# EAGLE schematic MOTHERBOARD (EAGLE 6.4)
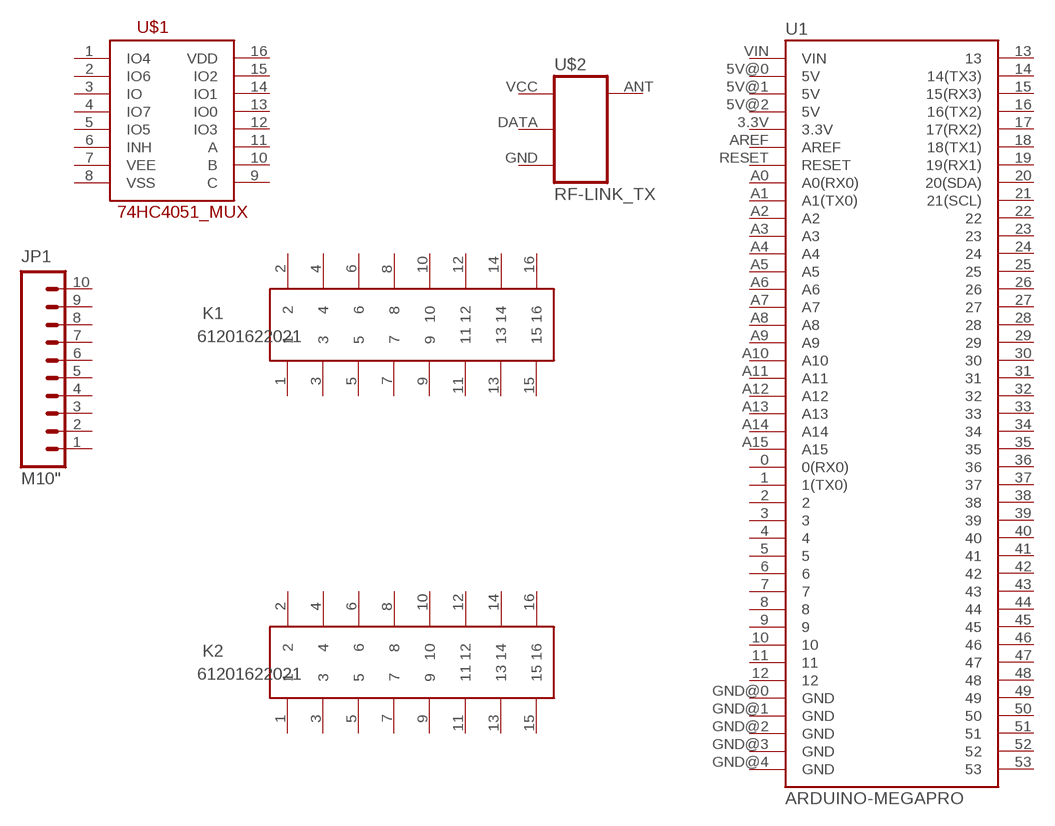
[diagram p0: schematic, sheet 1]

## Parts
JP1  M10"  [1X10]
K1  61201622021  [61201622021]
K2  61201622021  [61201622021]
U1  ARDUINO-MEGAPRO  [ARDUINO_MEGA-PRO-3.3V]
U$1  74HC4051_MUX  [SO16]
U$2  RF-LINK_TX  [RF-LINK_TX]
Unconnected: JP1.1 JP1.2 JP1.3 JP1.4 JP1.5 JP1.6 JP1.7 JP1.8 JP1.9 JP1.10 K1.1 K1.2 K1.3 K1.4 K1.5 K1.6 K1.7 K1.8 K1.9 K1.10 K1.11 K1.12 K1.13 K1.14 K1.15 K1.16 K2.1 K2.2 K2.3 K2.4 K2.5 K2.6 K2.7 K2.8 K2.9 K2.10 K2.11 K2.12 K2.13 K2.14 K2.15 K2.16 U1.0(0(RX0)) U1.1(1(TX0)) U1.2 U1.3 U1.3.3V U1.4 U1.5 U1.5V@0(5V) U1.5V@1(5V) U1.5V@2(5V) U1.6 U1.7 U1.8 U1.9 U1.10 U1.11 U1.12 U1.13 U1.14(14(TX3)) U1.15(15(RX3)) U1.16(16(TX2)) U1.17(17(RX2)) U1.18(18(TX1)) U1.19(19(RX1)) U1.20(20(SDA)) U1.21(21(SCL)) U1.22 U1.23 U1.24 U1.25 U1.26 U1.27 U1.28 U1.29 U1.30 U1.31 U1.32 U1.33 U1.34 U1.35 U1.36 U1.37 U1.38 U1.39 U1.40 U1.41 U1.42 U1.43 U1.44 U1.45 U1.46 U1.47 U1.48 U1.49 U1.50 U1.51 U1.52 U1.53 U1.A0(A0(RX0)) U1.A1(A1(TX0)) U1.A2 U1.A3 U1.A4 U1.A5 U1.A6 U1.A7 U1.A8 U1.A9 U1.A10 U1.A11 U1.A12 U1.A13 U1.A14 U1.A15 U1.AREF U1.GND@0(GND) U1.GND@1(GND) U1.GND@2(GND) U1.GND@3(GND) U1.GND@4(GND) U1.RESET U1.VIN U$1.1(IO4) U$1.2(IO6) U$1.3(IO) U$1.4(IO7) U$1.5(IO5) U$1.6(INH) U$1.7(VEE) U$1.8(VSS) U$1.9(C) U$1.10(B) U$1.11(A) U$1.12(IO3) U$1.13(IO0) U$1.14(IO1) U$1.15(IO2) U$1.16(VDD) U$2.ANT U$2.DATA

## Power pins joined to a net without a drawn wire
+5V: U$2.VCC(+5V)
GND: U$2.GND

## Library data of the parts
JP1 = SparkFun-Connectors:M10: Header 10 Standard 10-pin 0.1" header. Use with straight break away headers (SKU : PRT-00116), right angle break away headers (PRT-00553), swiss pins (PRT-00743), machine pins (PRT-00117), and female headers (PRT-00115).
K1 K2 = Wuerth_Elektronik_eiCan_05_Box_Header_IDC_Connectors_1_2:61201622021: WR-BHD 2.54mm Male Box Header With Lever, 16 Pins
U1 = SparkFun-Boards:ARDUINO-MEGA: Arduino Mega board footprint
U$1 = SparkFun-AnalogIC:74HC4051_MUX: 8:1 analog mux
U$2 = SparkFun-RF:RF-LINK_TX: RF Link transmitters WRL-8945, 8946